# EAGLE schematic TreeShield (EAGLE 6.4)
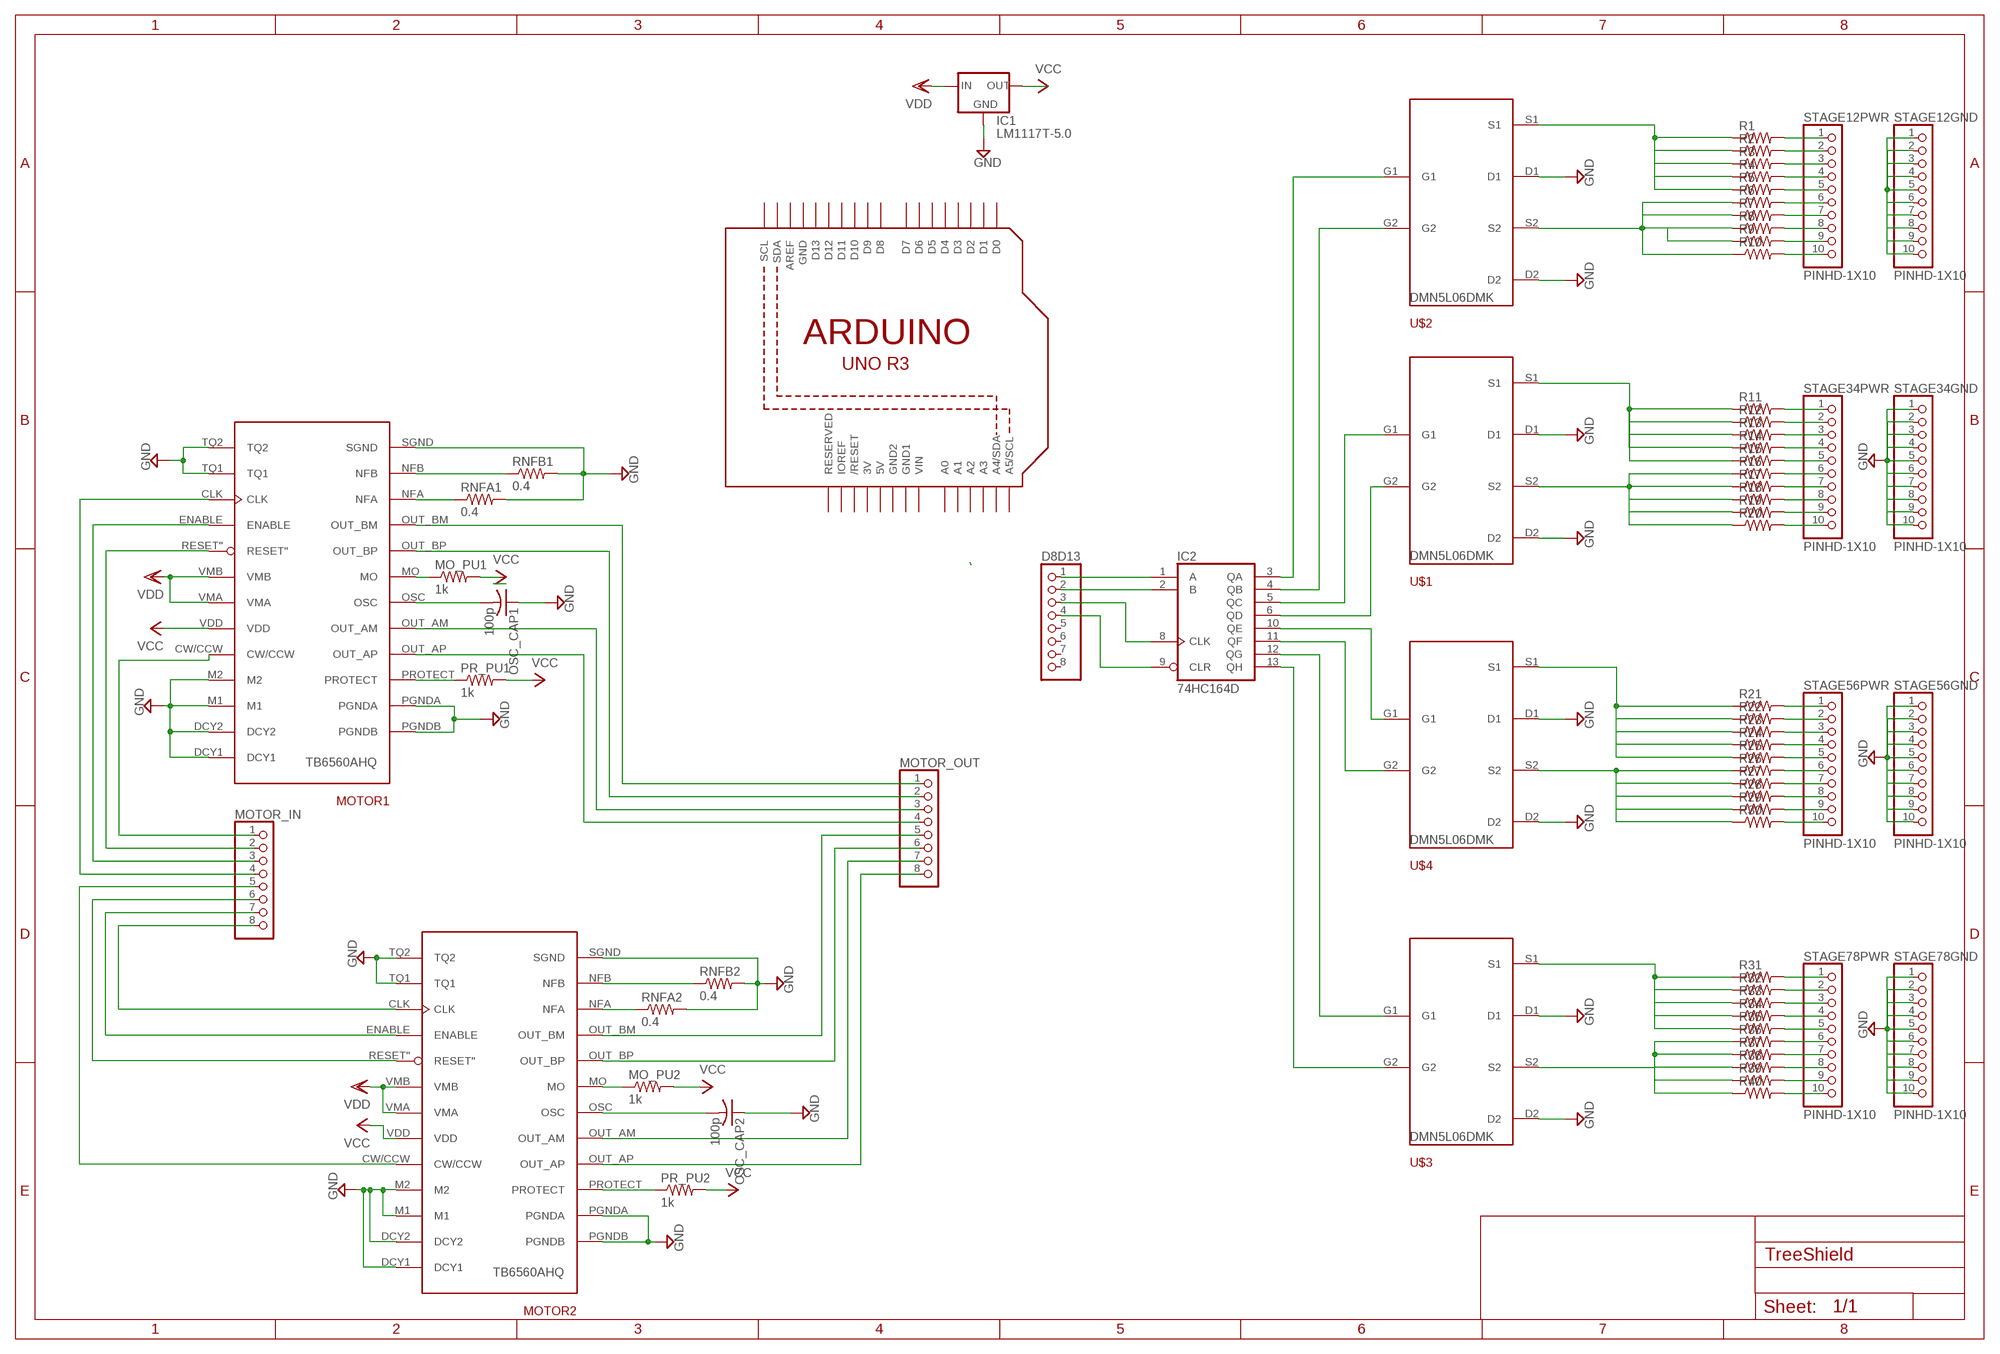
[diagram p0: schematic, sheet 1]

## Parts
D8D13  PINHD-1X8CLEANBIG  [1X08-CLEANBIG]
IC1  LM1117T-5.0  [TO220]
IC2  74HC164D  [SO14]
MO_PU1  1k  R-US_R0603  [R0603]
MO_PU2  1k  R-US_R0603  [R0603]
MOTOR1  TB6560AHQ  [TB6560AHQ]
MOTOR2  TB6560AHQ  [TB6560AHQ]
MOTOR_IN  PINHD-1X8CLEANBIG  [1X08-CLEANBIG]
MOTOR_OUT  PINHD-1X8CLEANBIG  [1X08-CLEANBIG]
OSC_CAP1  100p  C-USC0603  [C0603]
OSC_CAP2  100p  C-USC0603  [C0603]
PR_PU1  1k  R-US_R0603  [R0603]
PR_PU2  1k  R-US_R0603  [R0603]
R1  RESISTOR0603  [0603-RES]
R2  RESISTOR0603  [0603-RES]
R3  RESISTOR0603  [0603-RES]
R4  RESISTOR0603  [0603-RES]
R5  RESISTOR0603  [0603-RES]
R6  RESISTOR0603  [0603-RES]
R7  RESISTOR0603  [0603-RES]
R8  RESISTOR0603  [0603-RES]
R9  RESISTOR0603  [0603-RES]
R10  RESISTOR0603  [0603-RES]
R11  RESISTOR0603  [0603-RES]
R12  RESISTOR0603  [0603-RES]
R13  RESISTOR0603  [0603-RES]
R14  RESISTOR0603  [0603-RES]
R15  RESISTOR0603  [0603-RES]
R16  RESISTOR0603  [0603-RES]
R17  RESISTOR0603  [0603-RES]
R18  RESISTOR0603  [0603-RES]
R19  RESISTOR0603  [0603-RES]
R20  RESISTOR0603  [0603-RES]
R21  RESISTOR0603  [0603-RES]
R22  RESISTOR0603  [0603-RES]
R23  RESISTOR0603  [0603-RES]
R24  RESISTOR0603  [0603-RES]
R25  RESISTOR0603  [0603-RES]
R26  RESISTOR0603  [0603-RES]
R27  RESISTOR0603  [0603-RES]
R28  RESISTOR0603  [0603-RES]
R29  RESISTOR0603  [0603-RES]
R30  RESISTOR0603  [0603-RES]
R31  RESISTOR0603  [0603-RES]
R32  RESISTOR0603  [0603-RES]
R33  RESISTOR0603  [0603-RES]
R34  RESISTOR0603  [0603-RES]
R35  RESISTOR0603  [0603-RES]
R36  RESISTOR0603  [0603-RES]
R37  RESISTOR0603  [0603-RES]
R38  RESISTOR0603  [0603-RES]
R39  RESISTOR0603  [0603-RES]
R40  RESISTOR0603  [0603-RES]
RNFA1  0.4  R-US_0817/7V  [P0817V]
RNFA2  0.4  R-US_0817/7V  [P0817V]
RNFB1  0.4  R-US_0817/7V  [P0817V]
RNFB2  0.4  R-US_0817/7V  [P0817V]
STAGE12GND  PINHD-1X10  [1X10-BIG]
STAGE12PWR  PINHD-1X10  [1X10-BIG]
STAGE34GND  PINHD-1X10  [1X10-BIG]
STAGE34PWR  PINHD-1X10  [1X10-BIG]
STAGE56GND  PINHD-1X10  [1X10-BIG]
STAGE56PWR  PINHD-1X10  [1X10-BIG]
STAGE78GND  PINHD-1X10  [1X10-BIG]
STAGE78PWR  PINHD-1X10  [1X10-BIG]
U1  ARDUINOR3-BPLACE  [ARDUINOR3-BPLACE]
U$1  DMN5L06DMK  [DMN5L06DMK]
U$2  DMN5L06DMK  [DMN5L06DMK]
U$3  DMN5L06DMK  [DMN5L06DMK]
U$4  DMN5L06DMK  [DMN5L06DMK]

## Nets
CLK1: MOTOR1.CLK MOTOR_IN.4
CW1: MOTOR1.CW/CCW MOTOR_IN.1
EN1: MOTOR1.ENABLE MOTOR_IN.3
GND: IC1.1(GND) MOTOR1.DCY1 MOTOR1.DCY2 MOTOR1.M1 MOTOR1.M2 MOTOR1.PGNDA MOTOR1.PGNDB MOTOR1.SGND MOTOR1.TQ1 MOTOR1.TQ2 MOTOR2.DCY1 MOTOR2.DCY2 MOTOR2.M1 MOTOR2.M2 MOTOR2.PGNDA MOTOR2.PGNDB MOTOR2.SGND MOTOR2.TQ1 MOTOR2.TQ2 OSC_CAP1.1 OSC_CAP2.1 RNFA1.2 RNFA2.2 RNFB1.2 RNFB2.2 STAGE34GND.1 STAGE34GND.2 STAGE34GND.3 STAGE34GND.4 STAGE34GND.5 STAGE34GND.6 STAGE34GND.7 STAGE34GND.8 STAGE34GND.9 STAGE34GND.10 STAGE56GND.1 STAGE56GND.2 STAGE56GND.3 STAGE56GND.4 STAGE56GND.5 STAGE56GND.6 STAGE56GND.7 STAGE56GND.8 STAGE56GND.9 STAGE56GND.10 STAGE78GND.1 STAGE78GND.2 STAGE78GND.3 STAGE78GND.4 STAGE78GND.5 STAGE78GND.6 STAGE78GND.7 STAGE78GND.8 STAGE78GND.9 STAGE78GND.10 U$1.D1 U$1.D2 U$2.D1 U$2.D2 U$3.D1 U$3.D2 U$4.D1 U$4.D2
N$2: D8D13.1 IC2.1(A)
N$3: D8D13.2 IC2.2(B)
N$4: MOTOR1.NFA RNFA1.1
N$5: MO_PU1.1 MOTOR1.MO
N$6: MOTOR1.PROTECT PR_PU1.1
N$7: MOTOR1.OSC OSC_CAP1.2
N$8: R1.2 STAGE12PWR.1
N$9: R2.2 STAGE12PWR.2
N$10: MOTOR1.NFB RNFB1.1
N$11: MOTOR2.CW/CCW MOTOR_IN.5
N$12: MOTOR2.RESET'' MOTOR_IN.6
N$13: MOTOR2.ENABLE MOTOR_IN.7
N$14: MOTOR2.CLK MOTOR_IN.8
N$15: MOTOR2.NFB RNFB2.1
N$16: MOTOR2.NFA RNFA2.1
N$17: MO_PU2.1 MOTOR2.MO
N$18: MOTOR2.OSC OSC_CAP2.2
N$19: MOTOR2.PROTECT PR_PU2.1
N$20: R3.2 STAGE12PWR.3
N$21: R4.2 STAGE12PWR.4
N$22: R5.2 STAGE12PWR.5
N$23: R6.2 STAGE12PWR.6
N$24: R7.2 STAGE12PWR.7
N$25: R8.2 STAGE12PWR.8
N$26: D8D13.3 IC2.8(CLK)
N$27: D8D13.4 IC2.9(CLR)
N$28: IC2.3(QA) U$2.G1
N$29: IC2.4(QB) U$2.G2
N$30: IC2.5(QC) U$1.G1
N$31: IC2.6(QD) U$1.G2
N$32: R9.2 STAGE12PWR.9
N$33: R10.2 STAGE12PWR.10
N$34: R1.1 R2.1 R3.1 R4.1 R5.1 U$2.S1
N$35: R6.1 R7.1 R8.1 R9.1 R10.1 U$2.S2
N$36: R11.2 STAGE34PWR.1
N$37: R12.2 STAGE34PWR.2
N$38: R13.2 STAGE34PWR.3
N$39: R14.2 STAGE34PWR.4
N$40: R15.2 STAGE34PWR.5
N$41: R16.2 STAGE34PWR.6
N$42: R17.2 STAGE34PWR.7
N$43: R18.2 STAGE34PWR.8
N$44: R19.2 STAGE34PWR.9
N$45: R20.2 STAGE34PWR.10
N$46: R21.2 STAGE56PWR.1
N$47: R22.2 STAGE56PWR.2
N$48: R23.2 STAGE56PWR.3
N$49: R24.2 STAGE56PWR.4
N$50: R25.2 STAGE56PWR.5
N$51: R26.2 STAGE56PWR.6
N$52: R27.2 STAGE56PWR.7
N$53: R28.2 STAGE56PWR.8
N$54: R29.2 STAGE56PWR.9
N$55: R30.2 STAGE56PWR.10
N$56: R31.2 STAGE78PWR.1
N$57: R32.2 STAGE78PWR.2
N$58: R33.2 STAGE78PWR.3
N$59: R34.2 STAGE78PWR.4
N$60: R35.2 STAGE78PWR.5
N$61: R36.2 STAGE78PWR.6
N$62: R37.2 STAGE78PWR.7
N$63: R38.2 STAGE78PWR.8
N$64: R39.2 STAGE78PWR.9
N$65: R40.2 STAGE78PWR.10
N$66: R11.1 R12.1 R13.1 R14.1 R15.1 U$1.S1
N$67: IC2.13(QH) U$3.G2
N$68: IC2.12(QG) U$3.G1
N$69: IC2.11(QF) U$4.G2
N$70: IC2.10(QE) U$4.G1
N$71: R16.1 R17.1 R18.1 R19.1 R20.1 U$1.S2
N$72: R21.1 R22.1 R23.1 R24.1 R25.1 U$4.S1
N$73: R26.1 R27.1 R28.1 R29.1 R30.1 U$4.S2
N$74: R31.1 R32.1 R33.1 R34.1 R35.1 U$3.S1
N$75: R36.1 R37.1 R38.1 R39.1 R40.1 U$3.S2
N$76: STAGE12GND.1 STAGE12GND.2 STAGE12GND.3 STAGE12GND.4 STAGE12GND.5 STAGE12GND.6 STAGE12GND.7 STAGE12GND.8 STAGE12GND.9 STAGE12GND.10
OUT_AM1: MOTOR1.OUT_AM MOTOR_OUT.3
OUT_AM2: MOTOR2.OUT_AM MOTOR_OUT.7
OUT_AP1: MOTOR1.OUT_AP MOTOR_OUT.4
OUT_AP2: MOTOR2.OUT_AP MOTOR_OUT.8
OUT_BM1: MOTOR1.OUT_BM MOTOR_OUT.1
OUT_BM2: MOTOR2.OUT_BM MOTOR_OUT.5
OUT_BP1: MOTOR1.OUT_BP MOTOR_OUT.2
OUT_BP2: MOTOR2.OUT_BP MOTOR_OUT.6
RESET1: MOTOR1.RESET'' MOTOR_IN.2
VCC: IC1.2(OUT) MO_PU1.2 MO_PU2.2 MOTOR1.VDD MOTOR2.VDD PR_PU1.2 PR_PU2.2
VDD: IC1.3(IN) MOTOR1.VMA MOTOR1.VMB MOTOR2.VMA MOTOR2.VMB
Unconnected: D8D13.5 D8D13.6 D8D13.7 D8D13.8 U1.A0 U1.A1 U1.A2 U1.A3 U1.A4(A4/SDA) U1.A5(A5/SCL) U1.AREF U1.D0 U1.D1 U1.D2 U1.D3 U1.D4 U1.D5 U1.D6 U1.D7 U1.D8 U1.D9 U1.D10 U1.D11 U1.D12 U1.D13 U1.IOREF U1.RESERVED U1.RESET(/RESET) U1.SCL U1.SDA

## Power pins joined to a net without a drawn wire
3V: U1.3V
5V: U1.5V
GND: IC2.7(GND) U1.GND
GND1: U1.GND1
GND2: U1.GND2
VCC: IC2.14(VCC)
VIN: U1.VIN

## Library data of the parts
D8D13 MOTOR_IN MOTOR_OUT = adafruit:PINHD-1X8: PIN HEADER
IC1 = lm1117:LM1117T-*
IC2 = CD74ACT164M:74*164: 8-bit parallel out SHIFT REGISTER
MO_PU1 MO_PU2 PR_PU1 PR_PU2 = adafruit:R-US_: RESISTOR, American symbol
MOTOR1 MOTOR2 = TB6560AHQ:TB6560AHQ
OSC_CAP1 OSC_CAP2 = adafruit:C-US: CAPACITOR, American symbol
R1-R40 = SparkFun-Resistors:RESISTOR: Resistor Basic schematic elements and footprints for 0603, 1206, and PTH resistors.
RNFA1 RNFA2 RNFB1 RNFB2 = resistor:R-US_: RESISTOR, American symbol
STAGE12GND STAGE12PWR STAGE34GND STAGE34PWR STAGE56GND STAGE56PWR STAGE78GND STAGE78PWR = adafruit:PINHD-1X10: Pin header 1x10 0.1" spacing With round pins
U1 = adafruit:ARDUINOR3: This is a new object for the new Arduino R3 - with extra pins that you may want to use (such as IOref, and duplicated A4/A5
U$1-U$4 = DMN5L06DMK:DMN5L06DMK